# Altium schematic sheet 14-MT7688AN USB-PCIe.SchDoc
size A4
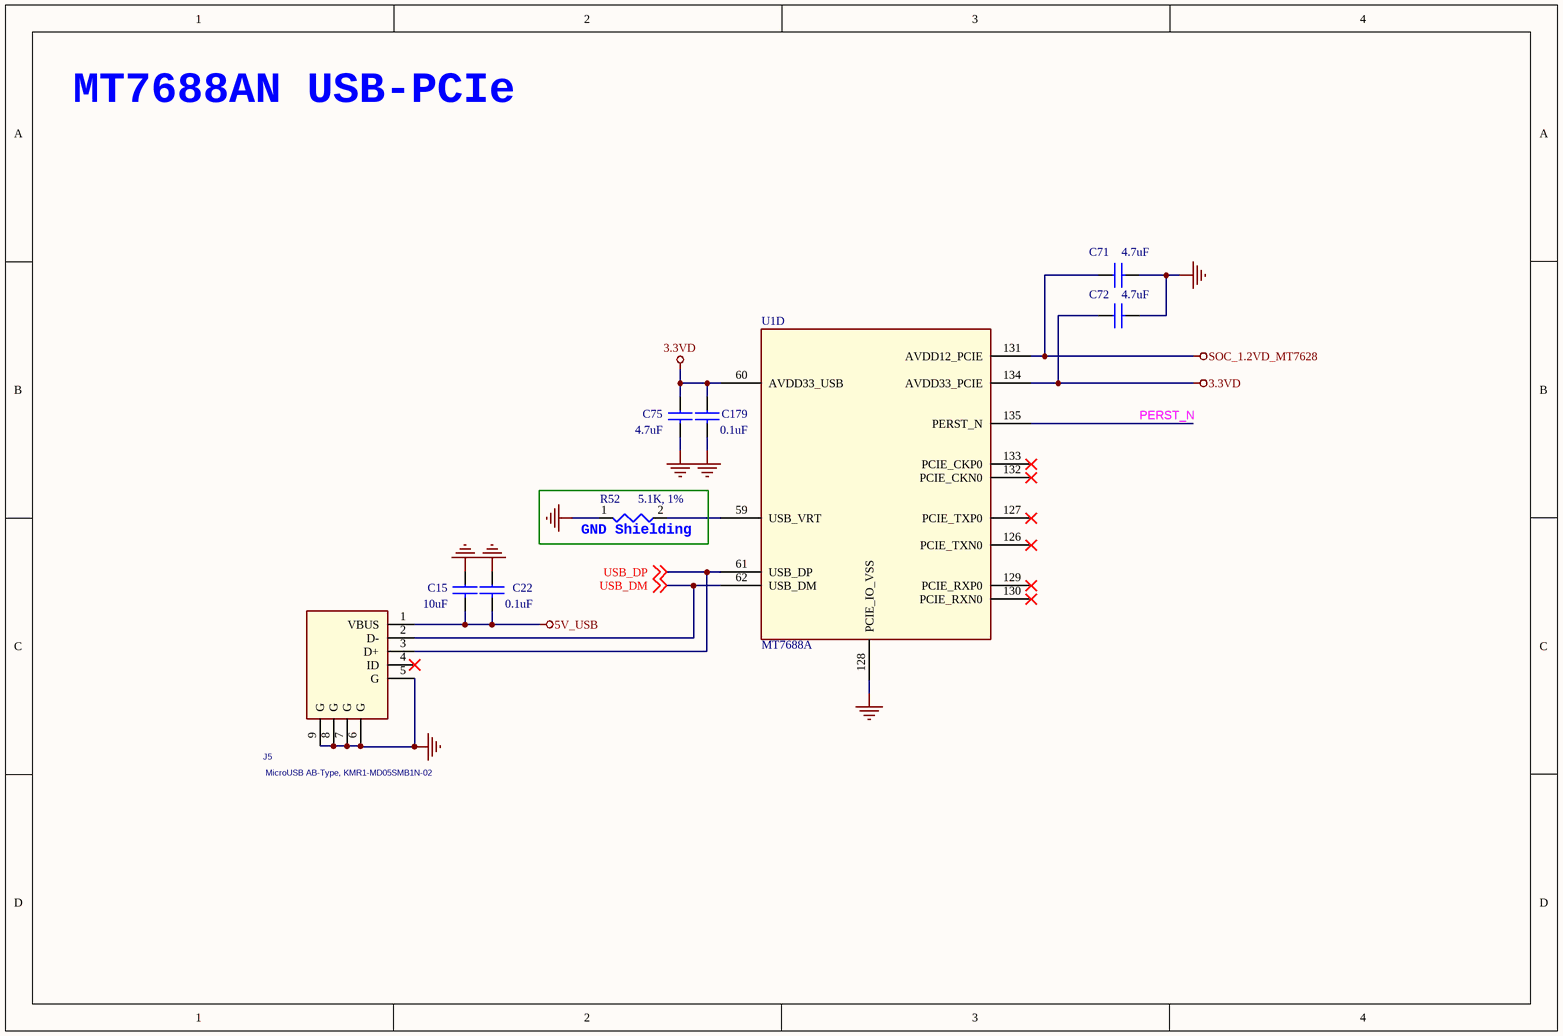
[diagram p0: 14-MT7688AN USB-PCIe.SchDoc]

## Parts
C15  10uF  [RLC 0402 M35]
C22  0.1uF  [RLC 0201 M35]
C71  4.7uF  [RLC 0402 M35]
C72  4.7uF  [RLC 0402 M35]
C75  4.7uF  [RLC 0402 M35]
C179  0.1uF  [RLC 0201 M35]
J5  MicroUSB AB-Type, KMR1-MD05SMB1N-02  [MicroUSB-AB]
R52  5.1K, 1%  [RLC 0201 M35]
U1  MT7688A  [MT7628AN$2F$DRQFN156$2F$SMD$2F$P0.5$2F$12X12]  (part D of 6)

## Blocks framed on the sheet
GND Shielding: R52

## Nets
3.3VD: C72.1 C75.1 C179.1 U1.60(AVDD33_USB) U1.134(AVDD33_PCIE)
5V_USB: C15.2 C22.2 J5.1(VBUS)
GND: C15.1 C22.1 C71.2 C72.2 C75.2 C179.2 J5.5(G) J5.6(G) J5.7(G) J5.8(G) J5.9(G) R52.1 U1.128(PCIE_IO_VSS)
SOC_1.2VD_MT7628: C71.1 U1.131(AVDD12_PCIE)
PERST_N: U1.135(PERST_N)
USB_DM: J5.2(D-) U1.62(USB_DM) ; off-sheet USB_DM
USB_DP: J5.3(D+) U1.61(USB_DP) ; off-sheet USB_DP
NetR52_2: R52.2 U1.59(USB_VRT)

Not connected (* = marked no-connect by the designer): J5 4(ID)*; U1 126(PCIE_TXN0)* 127(PCIE_TXP0)* 129(PCIE_RXP0)* 130(PCIE_RXN0)* 132(PCIE_CKN0)* 133(PCIE_CKP0)*

## Notes on the sheet
- MT7688AN USB-PCIe

## Library data of the parts
C15 C22 C71 C72 C75 C179 = CAP NP
J5 = Micro USB TYPE-AB: MicroUSB AB-Type; Manufacturer P/N: PJ-002BH-SMT; Manufacturer: CUI Inc.; Distributor: Digikey; Distributor P/N: CP-002BHPJTR-ND
R52 = RES/0402_3
U1 = MT7620N-n_26